# EAGLE schematic mainboard (EAGLE 9.6.2)
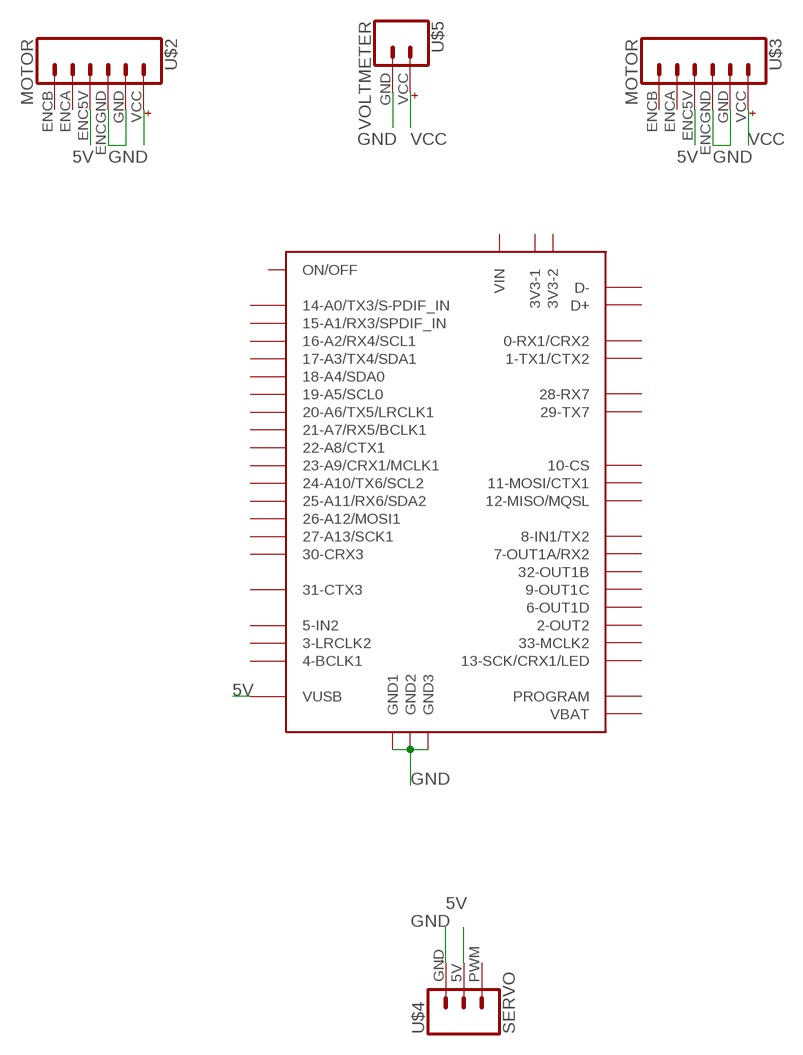
[diagram p0: schematic, sheet 1]

## Parts
U$1  TEENSY40  [TEENSY40]
U$2  MOTOR  [MOTOR]
U$3  MOTOR  [MOTOR]
U$4  SERVO  [SERVO]
U$5  VOLTMETER  [VOLTMETER]

## Nets
5V: U$1.VUSB U$2.ENC5V U$3.ENC5V U$4.5V
GND: U$1.GND1 U$1.GND2 U$1.GND3 U$2.ENCGND U$2.GND U$3.ENCGND U$3.GND U$4.GND U$5.GND
N$1: U$2.VCC
VCC: U$3.VCC U$5.VCC
Unconnected: U$1.0-RX1(0-RX1/CRX2) U$1.1-TX1(1-TX1/CTX2) U$1.2-OUT2 U$1.3-LRCLK2 U$1.3V3-1 U$1.3V3-2 U$1.4-BCLK2(4-BCLK1) U$1.5-IN2 U$1.6-OUT1D U$1.7-RX2/OUT1A(7-OUT1A/RX2) U$1.8-TX2/IN1(8-IN1/TX2) U$1.9-OUT1C U$1.10-CS/MQSR(10-CS) U$1.11-MOSI/CTX1 U$1.12-MIO/MQSL(12-MISO/MQSL) U$1.13-SCK/CRX1/LED U$1.14-A0/TX3/S-PFI_OUT(14-A0/TX3/S-PDIF_IN) U$1.15-A1/RX3/S-PDIF_IN(15-A1/RX3/SPDIF_IN) U$1.16-A2/RX4/SCL1 U$1.17-A3/TX4/SDA1 U$1.18-A4/SDA0 U$1.19-A5/SCL0 U$1.20-A6/TX5/LRCLK1 U$1.21-A7/RX5/BCLK1 U$1.22-A8/CTX1 U$1.23-A9/CRX1/CCLK1(23-A9/CRX1/MCLK1) U$1.24-A10/TX6/SCL2 U$1.25-A11/SDA2(25-A11/RX6/SDA2) U$1.26-A12/MOSI1 U$1.27-A13/SCK1 U$1.28-RX7 U$1.29-TX7 U$1.30-CRX3 U$1.31-CTX3 U$1.32-OUTB1(32-OUT1B) U$1.33-MCLK2 U$1.D+ U$1.D- U$1.ON/OFF U$1.PROGRAM U$1.VBAT U$1.VIN U$2.ENCA U$2.ENCB U$3.ENCA U$3.ENCB U$4.PWM

## Library data of the parts
U$1 = teensy:TEENSY40: Teensy 4.0 device including POGO pins for pins 24 - 33, but not yet pins for D+ and D-. Symbol layout is what works for me and may not suite everyone... that can be added or additional symbols can be created to be used in a modilied davie name.
U$2 U$3 = custom:MOTOR
U$4 = custom:SERVO
U$5 = custom:VOLTMETER